# EAGLE design noisesource (EAGLE 6.6.0)
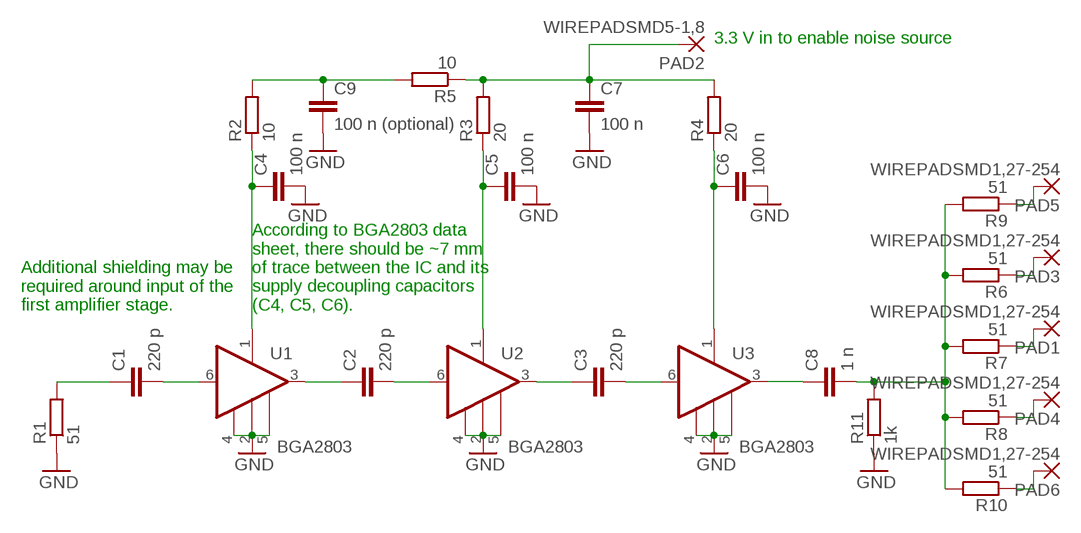
[diagram p0: schematic, sheet 1]

## Parts
C1  220 p  C-EUC0805  [C0805]
C2  220 p  C-EUC0805  [C0805]
C3  220 p  C-EUC0805  [C0805]
C4  100 n  C-EUC0805  [C0805]
C5  100 n  C-EUC0805  [C0805]
C6  100 n  C-EUC0805  [C0805]
C7  100 n  C-EUC0805  [C0805]
C8  1 n  C-EUC0805  [C0805]
C9  100 n (optional)  C-EUC0805  [C0805]
PAD1  WIREPADSMD1,27-254  [SMD1,27-2,54]
PAD2  WIREPADSMD5-1,8  [5-1,8]
PAD3  WIREPADSMD1,27-254  [SMD1,27-2,54]
PAD4  WIREPADSMD1,27-254  [SMD1,27-2,54]
PAD5  WIREPADSMD1,27-254  [SMD1,27-2,54]
PAD6  WIREPADSMD1,27-254  [SMD1,27-2,54]
R1  51  R-EU_R0805  [R0805]
R2  10  R-EU_R0805  [R0805]
R3  20  R-EU_R0805  [R0805]
R4  20  R-EU_R0805  [R0805]
R5  10  R-EU_R0805  [R0805]
R6  51  R-EU_R0805  [R0805]
R7  51  R-EU_R0805  [R0805]
R8  51  R-EU_R0805  [R0805]
R9  51  R-EU_R0805  [R0805]
R10  51  R-EU_R0805  [R0805]
R11  1k  R-EU_R0805  [R0805]
U1  BGA2803  BGA2850  [SOT363]
U2  BGA2803  BGA2850  [SOT363]
U3  BGA2803  BGA2850  [SOT363]

## Nets
GND: C4.2 C5.2 C6.2 C7.2 C9.2 R1.1 R11.1 U1.2(GND2) U1.4(GND1) U1.5(GND2) U2.2(GND2) U2.4(GND1) U2.5(GND2) U3.2(GND2) U3.4(GND1) U3.5(GND2)
N$1: C2.1 U1.3(OUT)
N$2: C2.2 U2.6(-IN)
N$3: C3.1 U2.3(OUT)
N$4: C3.2 U3.6(-IN)
N$5: C1.1 R1.2
N$6: C1.2 U1.6(-IN)
N$7: C4.1 R2.1 U1.1(VCC)
N$8: C5.1 R3.1 U2.1(VCC)
N$9: C6.1 R4.1 U3.1(VCC)
N$10: C7.1 PAD2.1(P) R3.2 R4.2 R5.1
N$11: C8.1 U3.3(OUT)
N$12: PAD1.1(P) R7.1
N$13: C9.1 R2.2 R5.2
N$14: PAD3.1(P) R6.1
N$15: PAD4.1(P) R8.1
N$16: PAD5.1(P) R9.1
N$17: PAD6.1(P) R10.1
N$18: C8.2 R6.2 R7.2 R8.2 R9.2 R10.2 R11.2

## Notes on the sheet
- 3.3 V in to enable noise source
- Additional shielding may be
  required around input of the
  first amplifier stage.
- According to BGA2803 data
  sheet, there should be ~7 mm
  of trace between the IC and its
  supply decoupling capacitors
  (C4, C5, C6).

## Library data of the parts
C1-C9 = rcl:C-EU: CAPACITOR, European symbol
PAD1-PAD6 = wirepad:WIREPAD: Wire PAD connect wire on PCB
R1-R11 = rcl:R-EU_: RESISTOR, European symbol
U1-U3 = nxp_60_1_1:BGA2850: Silicon Monolithic Microwave Integrated Circuit (MMIC) wideband amplifier with internal matching circuit in a 6-pin SOT363 plastic SMD package. AAL Eindhoven MV+ MK; 12NC: 9352 900 54115

## Board
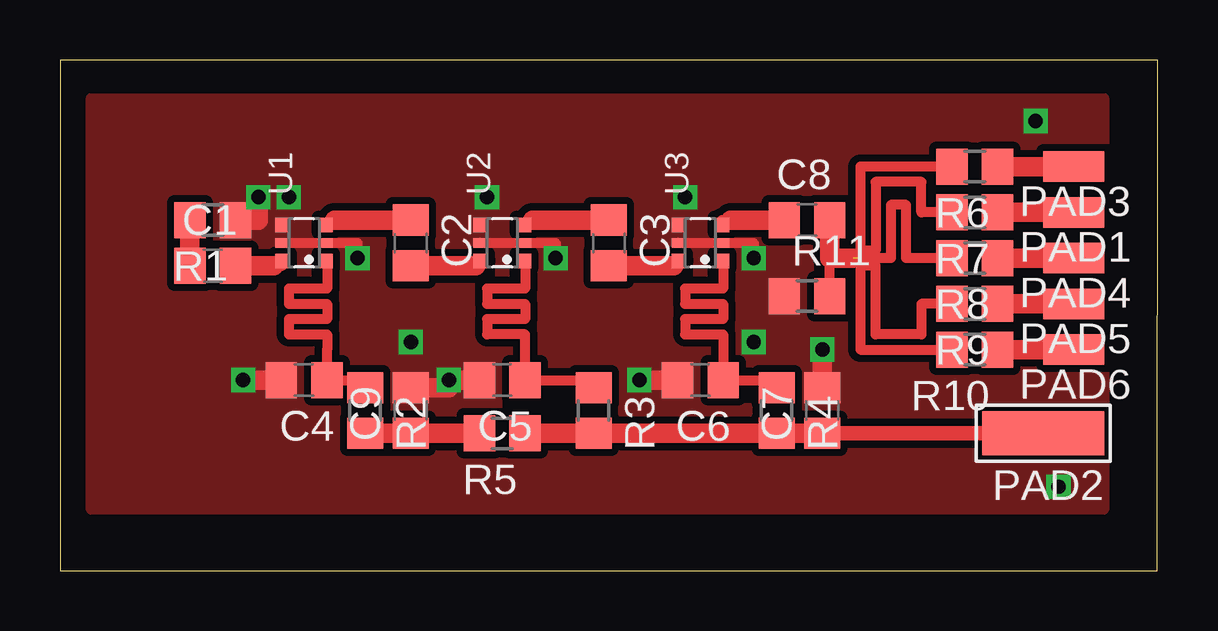
[diagram p1: board, top side]
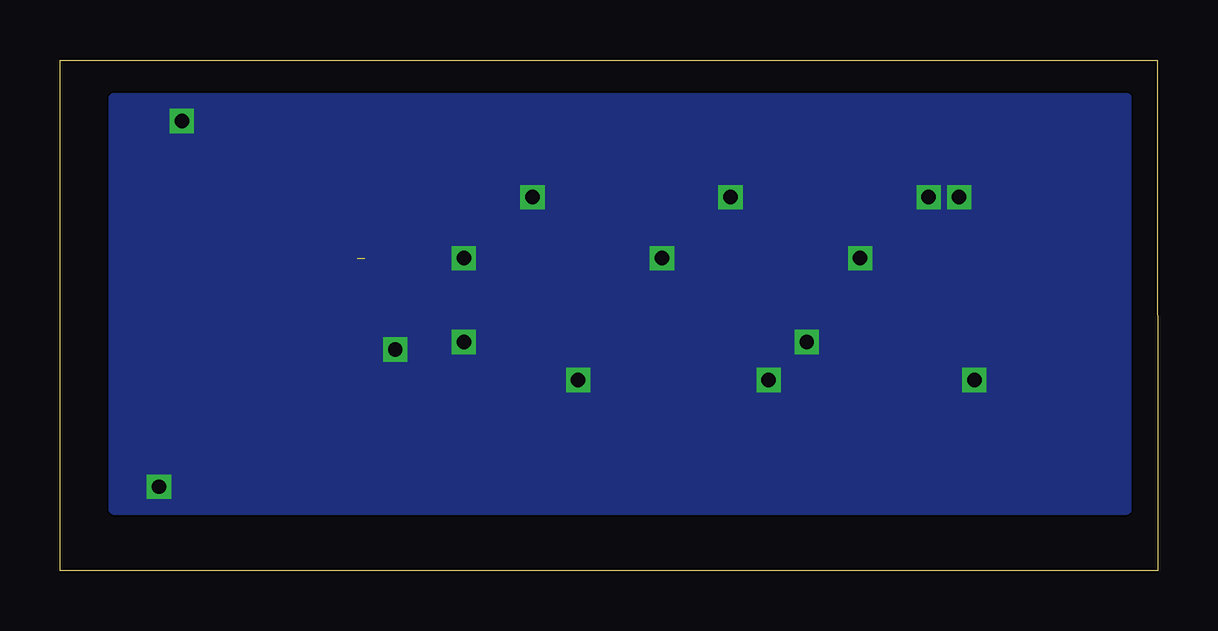
[diagram p2: board, bottom side, seen from below]

Size 45.73 x 21.28 mm. Coordinates in mm from the lower left corner, seen from the top.
Outline: 0.01,21.28 0,0.01 45.72,0 45.73,21.27 0.01,21.28
Copper layers (1*16): Top 0.035mm / dielectric 1.5mm / Bottom 0.035mm
Design rules "default": minimum track width 10mil, minimum drill 24mil, track to track 8mil, track to pad 8mil, pad to pad 8mil, via to via 8mil, smd to smd 8mil, copper to edge 40mil, drill to drill 8mil, minimum pad ring 10mil, minimum via ring 8mil, stop-mask expansion 4mil, vias tented up to drill 0mil, thermal gap 10mil

### Footprints (pad centres in the part's own frame; a part is rotated, then mirrored left to right if it is on the bottom)
C0805 = smd 1.3 x 1.5: 1 -0.95,0; 2 0.95,0
SMD1,27-2,54 = smd 1.27 x 2.54: 1 0,0
5-1,8 = smd 1.829 x 5.08: 1 0,0
R0805 = smd 1.3 x 1.5: 1 -0.95,0; 2 0.95,0
SOT363 = smd 0.6 x 0.6: 1 -0.75,-0.9; 3 0.75,-0.9; 4 0.75,0.9; 6 -0.75,0.9 | smd 0.4 x 0.6: 2 0,-0.9; 5 0,0.9

### Placement (x,y rotation side)
C1  6.36,12.71 0 top
C2  14.62,13.66 270 top
C3  22.87,13.66 270 top
C4  10.17,7.95 180 top
C5  18.43,7.95 180 top
C6  26.68,7.95 180 top
C7  31.76,6.68 90 top
C8  31.13,14.62 0 top
C9  14.62,6.68 90 top
PAD1  42.24,14.93 90 top
PAD2  40.97,5.72 90 top
PAD3  42.24,16.84 90 top
PAD4  42.24,13.03 90 top
PAD5  42.24,11.12 90 top
PAD6  42.24,9.22 90 top
R1  6.36,14.62 180 top
R2  12.71,6.68 270 top
R3  22.24,6.68 270 top
R4  29.86,6.68 270 top
R5  18.43,5.72 180 top
R6  38.11,16.84 180 top
R7  38.11,14.93 180 top
R8  38.11,13.03 180 top
R9  38.11,11.12 180 top
R10  38.11,9.22 180 top
R11  31.13,11.44 0 top
U1  10.17,13.66 90 top
U2  18.43,13.66 90 top
U3  26.68,13.66 90 top

### Tracks (layer width: path | path; a pad name or v marks a point on that pad's centre or on a via)
GND  (via drill 0.6)
  Top 0.406: U1.4 9.22,14.41 | 17.47,13.66 U2.5 U2.2 20.65,13.66 v20.65,13.03 | 25.73,13.66 U3.5 U3.2 28.9,13.66 v28.9,13.03 | v12.4,13.03 12.4,13.66 U1.2 U1.5
  Top 0.813: v7.63,7.95 C4.2 | C5.2 v16.2,7.95 16.2,7.63 C9.2 | v24.14,7.95 C6.2 | v31.76,9.22 C7.2 | R1.1 8.27,14.62 v8.27,15.57
  other vias: 9.54,15.57 17.79,15.57 26.05,15.57 14.62,9.54 28.91,9.54 40.65,18.74 41.61,3.5
  pour Bottom: 1.28,2.55 1.28,19.7 43.51,19.7 43.51,2.55
  pour Top (isolate 0.305, no thermals): 1.28,2.55 1.28,19.7 43.51,19.7 43.51,2.55
N$1
  Top 0.406: U1.3 11.44,14.41 11.44,14.62
  Top 0.813: C2.1 11.44,14.61 11.44,14.62
N$2
  Top 0.61: 17.33,12.71 U2.6
  Top 0.813: C2.2 17.33,12.71
N$3
  Top 0.406: U2.3 20.01,14.41 20.01,14.61
  Top 0.813: C3.1 20.01,14.61 19.7,14.61 19.7,14.62
N$4
  Top 0.61: 25.58,12.71 U3.6
  Top 0.813: C3.2 25.58,12.71
N$5
  Top 0.813: C1.1 R1.2
N$6
  Top 0.406: 8.9,12.71 9.27,12.71 U1.6
  Top 0.813: C1.2 8.9,12.71
N$7
  Top 0.406: U1.1 11.13,12.91 11.13,11.76 9.54,11.76 9.54,11.12 11.13,11.12 11.13,10.49 9.54,10.49 9.54,9.85 11.13,9.85 11.13,9.22 11.12,9.22 C4.1 12.71,7.95 R2.1
N$8
  Top 0.406: U2.1 19.38,12.91 19.38,11.76 17.79,11.76 17.79,11.12 19.38,11.12 19.38,10.49 17.79,10.49 17.79,9.85 19.38,9.85 C5.1 22.24,7.95 R3.1
N$9
  Top 0.406: U3.1 27.64,12.91 27.64,11.76 26.05,11.76 26.05,11.12 27.64,11.12 27.64,10.49 26.05,10.49 26.05,9.85 27.63,9.85 C6.1 29.86,7.95 R4.1
N$10
  Top 0.61: C7.1 PAD2.1
  Top 0.813: R5.1 R3.2 R4.2 C7.1
N$11
  Top 0.406: 27.95,14.62 27.58,14.62 U3.3
  Top 0.813: C8.1 27.95,14.62
N$12
  Top 0.813: R7.1 PAD1.1
N$13
  Top 0.813: R2.2 C9.1 R5.2
N$14
  Top 0.813: R6.1 PAD3.1
N$15
  Top 0.813: PAD4.1 R8.1
N$16
  Top 0.813: R9.1 PAD5.1
N$17
  Top 0.813: PAD6.1 R10.1
N$18  (1 unrouted)
  Top 0.406: R6.2 33.35,16.84 33.35,13.35 | 33.35,13.35 33.35,13.03 | 33.35,13.03 33.35,12.71 | 33.35,12.71 33.35,9.22 R10.2 | R7.2 35.89,14.93 35.89,16.2 33.98,16.2 33.98,13.35 33.35,13.35 | R9.2 35.89,11.12 35.89,9.85 33.98,9.85 33.98,12.71 33.35,12.71 | R8.2 35.26,13.03 35.26,15.25 34.62,15.25 34.62,13.03 33.35,13.03 | R11.2 32.08,13.03
  Top 0.813: C8.2 32.08,13.03 33.03,13.03